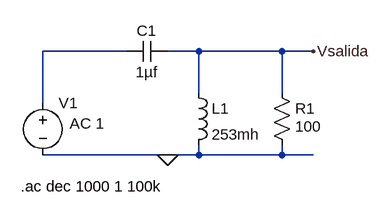
[diagram p0: schematic LtSpice TP3.asc]
LtSpice TP3.asc, the LTspice schematic file:
Version 4
SHEET 1 880 680
WIRE 96 48 -32 48
WIRE 208 48 160 48
WIRE 336 48 208 48
WIRE 384 48 336 48
WIRE 208 112 208 48
WIRE 336 112 336 48
WIRE -32 128 -32 48
WIRE 160 208 -32 208
WIRE 208 208 208 192
WIRE 208 208 160 208
WIRE 336 208 336 192
WIRE 336 208 208 208
WIRE 384 208 336 208
FLAG 160 208 0
FLAG 384 48 Vsalida
SYMBOL voltage -32 112 R0
WINDOW 3 38 77 Left 2
WINDOW 123 41 47 Left 2
WINDOW 39 0 0 Left 0
SYMATTR InstName V1
SYMATTR Value ""
SYMATTR Value2 AC 1
SYMBOL ind 192 96 R0
SYMATTR InstName L1
SYMATTR Value 253mh
SYMBOL cap 160 32 R90
WINDOW 0 0 32 VBottom 2
WINDOW 3 32 32 VTop 2
SYMATTR InstName C1
SYMATTR Value 1µf
SYMBOL res 320 96 R0
WINDOW 3 36 68 Left 2
SYMATTR InstName R1
SYMATTR Value 100
TEXT -66 256 Left 2 !.ac dec 1000 1 100k

The netlist it stands for:
* LtSpice TP3.asc
V1 N001 0 AC 1
L1 Vsalida 0 253mh
C1 Vsalida N001 1µf
R1 Vsalida 0 100
.ac dec 1000 1 100k
.backanno
.end